# Altium schematic sheet PiTopUSBHub.SchDoc: Main USB Hub
size A4; Author: Sorgelig; Revision: 3.0; SheetNumber: 1; SheetTotal: 2
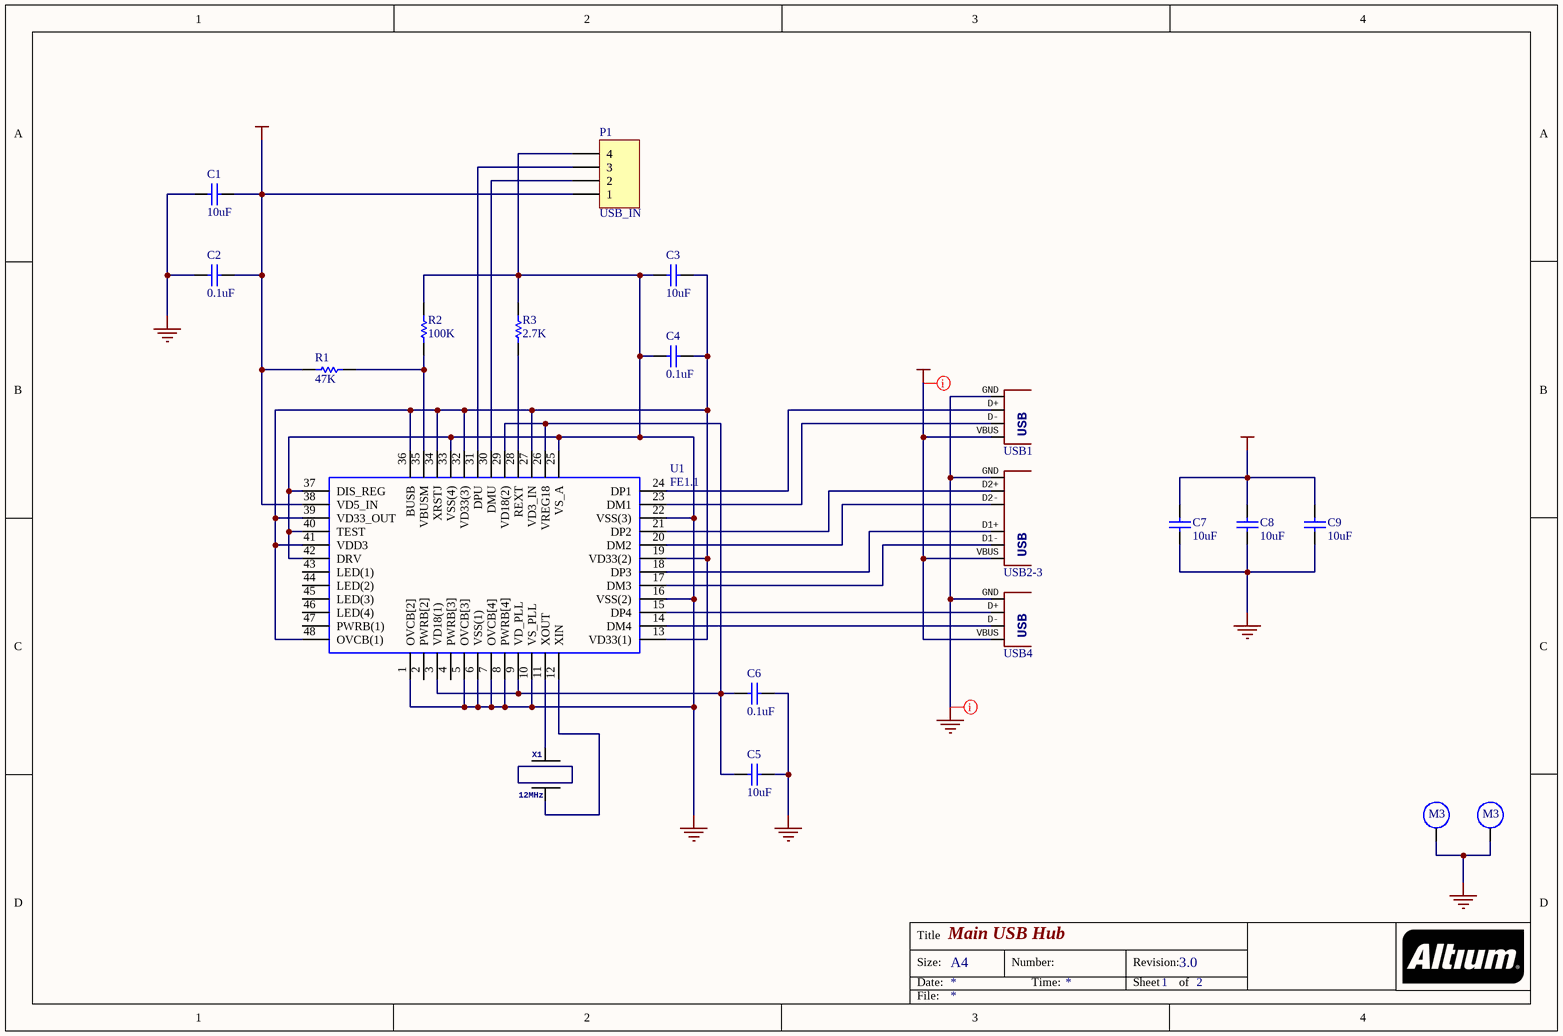
[diagram p0: PiTopUSBHub.SchDoc]

## Parts
C1  value 10uF  [C0805]  (hidden comment: C0805)
C2  value 0.1uF  [C0805]  (hidden comment: C0805)
C3  value 10uF  [C0805]  (hidden comment: C0805)
C4  value 0.1uF  [C0805]  (hidden comment: C0805)
C5  value 10uF  [C0805]  (hidden comment: C0805)
C6  value 0.1uF  [C0805]  (hidden comment: C0805)
C7  value 10uF  [C0805]  (hidden comment: C0805)
C8  value 10uF  [C0805]  (hidden comment: C0805)
C9  value 10uF  [C0805]  (hidden comment: C0805)
H1  M3  [M3]  (value not drawn)
H2  M3  [M3]  (value not drawn)
P1  USB_IN  [HDR1X4]
R1  47K  [R0805]
R2  100K  [R0805]
R3  2.7K  [R0805]
U1  FE1.1  [LQFP48]
USB1  USBA-PTH  [USB-A-F-PTH]  (value not drawn)
USB2-3  USBA2x-PTH  [USB-A-2x-F-PTH]  (value not drawn)
USB4  USBA-PTH  [USB-A-F-PTH]  (value not drawn)
X1  12MHz  [XTAL_G5032]

## Nets
GND: C1.2 C2.2 C3.2 C4.2 C5.2 C6.2 C7.2 C8.2 C9.2 H1.1 H2.1 P1.4 R2.1 R3.2 U1.1(OVCB[2]) U1.5(OVCB[3]) U1.6(VSS(1)) U1.7(OVCB[4]) U1.8(PWRB[4]) U1.10(VS_PLL) U1.16(VSS(2)) U1.22(VSS(3)) U1.25(VS_A) U1.33(VSS(4)) U1.37(DIS_REG) U1.40(TEST) U1.42(DRV) USB1.GND USB2-3.GND USB4.GND
VCC: C1.1 C2.1 C7.1 C8.1 C9.1 P1.1 R1.1 U1.38(VD5_IN) USB1.VBUS USB2-3.VBUS USB4.VBUS
NetC3_1: C3.1 C4.1 U1.13(VD33(1)) U1.19(VD33(2)) U1.27(VD3_IN) U1.32(VD33(3)) U1.34(XRSTJ) U1.36(BUSB) U1.39(VD33_OUT) U1.41(VDD3) U1.48(OVCB(1))
NetC5_1: C5.1 C6.1 U1.3(VD18(1)) U1.9(VD_PLL) U1.26(VREG18) U1.29(VD18(2))
NetP1_2: P1.2 U1.30(DMU)
NetP1_3: P1.3 U1.31(DPU)
NetR1_2: R1.2 R2.2 U1.35(VBUSM)
NetR3_1: R3.1 U1.28(REXT)
NetU1_11: U1.11(XOUT) X1.2
NetU1_12: U1.12(XIN) X1.1
NetU1_14: U1.14(DM4) USB4.D-
NetU1_15: U1.15(DP4) USB4.D+
NetU1_17: U1.17(DM3) USB2-3.D1-
NetU1_18: U1.18(DP3) USB2-3.D1+
NetU1_20: U1.20(DM2) USB2-3.D2-
NetU1_21: U1.21(DP2) USB2-3.D2+
NetU1_23: U1.23(DM1) USB1.D-
NetU1_24: U1.24(DP1) USB1.D+

Not connected (* = marked no-connect by the designer): U1 2(PWRB[2]) 4(PWRB[3]) 43(LED(1)) 44(LED(2)) 45(LED(3)) 46(LED(4)) 47(PWRB(1))

## Layout directives
net class power: GND, VCC

## Notes on the sheet
- Title
- Size:
- Date:
- A4
- Number:
- Time:
- Revision:
- Sheet
- of
- File:

## Library data of the parts
C1-C9 = C0805: Ceramic Chip Capacitor - Standard; Note: Footprint corresponds to dimensions for bulk cassette packaging. This case size has tightened tolerances.; Published: 17-Jul-2002; LatestRevisionDate: 19-Mar-2004; LatestRevisionNote: Silkscreen size reduced.; DatasheetDocument: Mar-2001; PackageDocument: Mar-2001; PackageReference: 0805; Publisher: Altium Limited; Code_JEITA: 0805; Code_IPC: 2012[0805]; ComponentLink1Description: Manufacturer Link; ComponentLink1URL: http://www.kemet.com/; ComponentLink2Description: Datasheet; ComponentLink2URL: http://www.kemet.com/kemet/web/homepage/kechome.nsf/vapubfilesname/F3102TA.pdf/$file/F3102TA.pdf
P1 = Header 4: Header, 4-Pin; LatestRevisionDate: 17-Jul-2002; LatestRevisionNote: Re-released for DXP Platform.; Publisher: Altium Limited
R1-R3 = ERJ6RS: Low Ohmic Value Thick Film Chip Resistor, 0.1 Ohm to 0.2 Ohm Range, 1%, 2% and 5% Tolerance, 0805 Size, 0.125 W; Published: 17-Dec-2003; LatestRevisionDate: 19-Mar-2004; LatestRevisionNote: Silkscreen size reduced.; PackageDocument: Mar-2003; PackageReference: 6-0805; Publisher: Altium Limited; Code_IPC: 2012 [0805]; ComponentLink1Description: Manufacturer Link; ComponentLink1URL: http://www.panasonic.com/industrial/components/resistive_products.htm; ComponentLink2Description: Datasheet; ComponentLink2URL: http://www.panasonic.com/industrial/components/pdf/AOA0000CE3.pdf
U1 = FE1.1: USB 2.0 HIGH SPEED 4-PORT HUB CONTROLLER; Manufacturer_Name: Terminus Technology; Geometry.Height: 1.6mm; Manufacturer_Part_Number: FE1.1; RS Part Number: *; RS Price/Stock: *; Datasheet Link: http://elinux.org/images/e/ee/FE11-datasheet.pdf
X1 = CRYSTALHC49UP: PTH: ...   SMD: ...   Cylinder: CMR200T-32.768KDZBT
USB1 USB4 = USBA-PTH: USB: USB
USB2-3 = USBA2x-PTH: USB: USB